# Altium project PCB_Project.PrjPcb
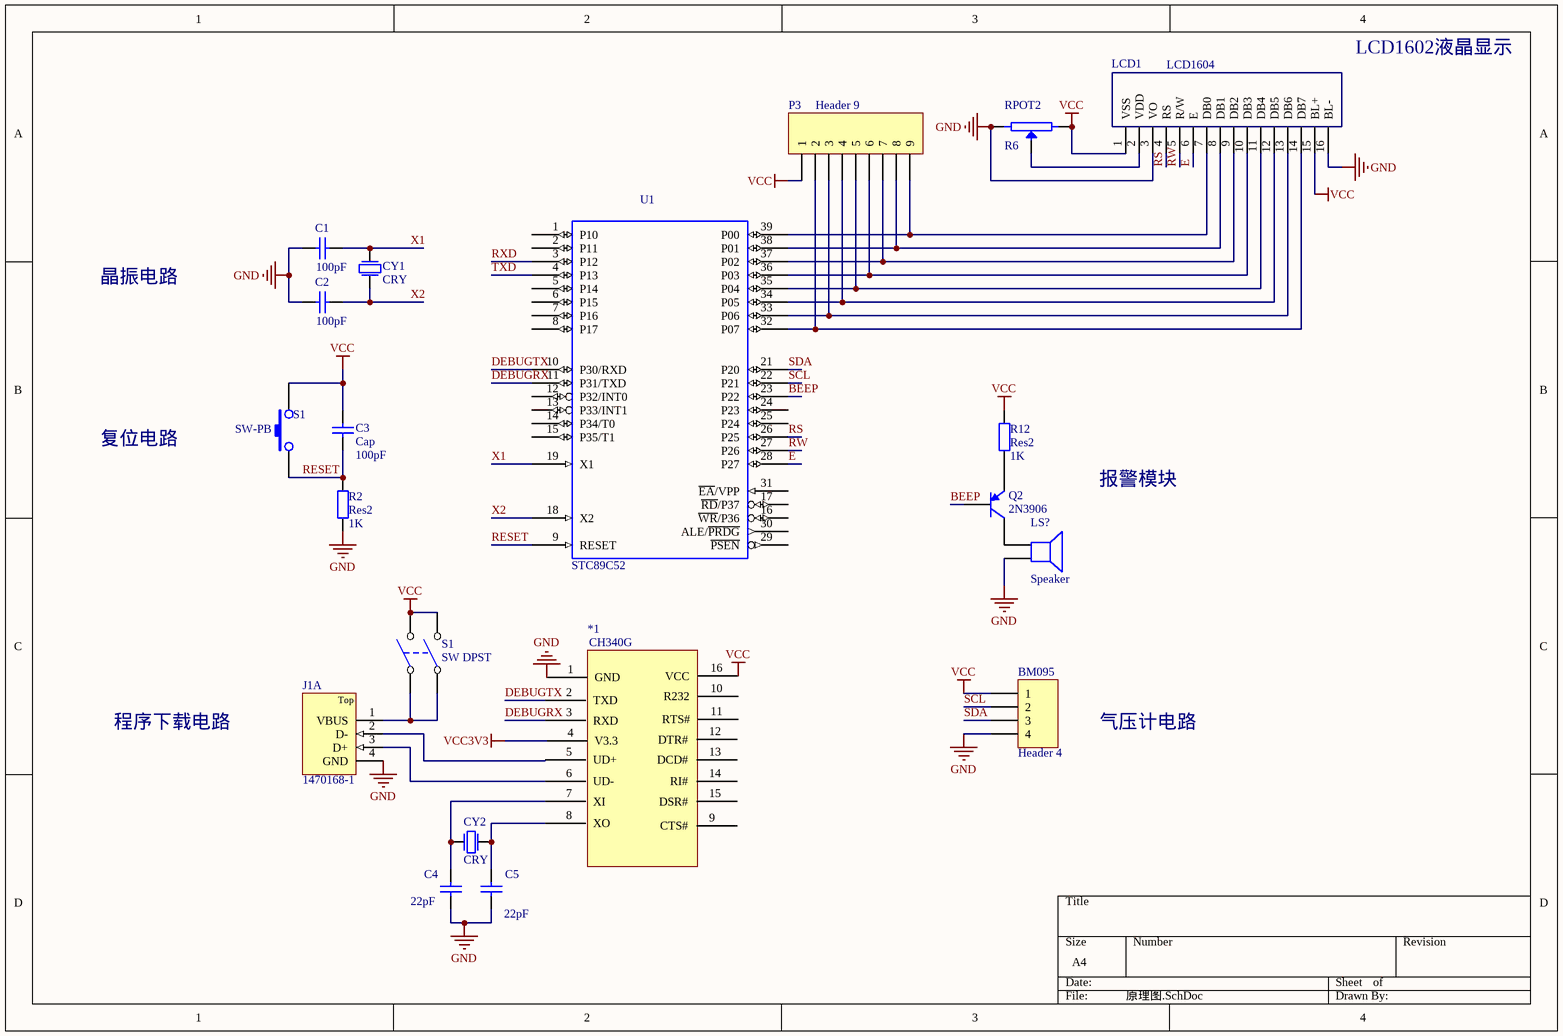
[diagram p0: 原理图.SchDoc]
1 sheet, 20 parts. Net scope: global (net labels, ports and power ports of the same name join across sheets).

## Sheet 原理图.SchDoc
size A4

### Parts
(Parts that share a designator on the sheet are numbered #1, #2 ... from top to bottom, then left to right.)
*1  Component_1  (value not drawn)
BM095  Header 4  [HDR1X4]
C1  value 100pF  [RAD-0.3]  (hidden comment: Cap)
C2  value 100pF  [RAD-0.3]  (hidden comment: Cap)
C3  Cap  value 100pF  [RAD-0.3]
C4  value 22pF  [RAD-0.3]  (hidden comment: Cap)
C5  value 22pF  [RAD-0.3]  (hidden comment: Cap)
CY1  CRY  [XTAL-1]
CY2  CRY  [XTAL-1]
J1  1470168-1  [1470168]  (part A of 3)
LCD1  LCD1604  [LCD1602]
LS?  Speaker  [PIN2]
P3  Header 9  [HDR1X9]
Q2  2N3906  [TO-92A]
R2  Res2  value 1K  [AXIAL-0.4]
R6  RPOT2  [VR5]
R12  Res2  value 1K  [AXIAL-0.4]
S1#1  SW-PB
S1#2  SW DPST
U1  STC89C52  [DIP-40]

### Nets
GND: *1.1(GND) BM095.4 C1.1 C2.1 C4.2 C5.1 J1.4(GND) LCD1.3(VO) LCD1.16(BL-) LS?.2 R2.1 R6.3 U1.20(GND)
VCC: *1.16(VCC) BM095.1 C3.2 LCD1.1(VSS) LCD1.15(BL+) P3.1 R6.1 R12.2 S1#1.2 S1#2.2(NO1) S1#2.4(NO2) U1.40(VCC)
VCC3V3: *1.4(V3.3)
BEEP: Q2.2(B) U1.23(P22)
DEBUGRX: *1.3(RXD) U1.11(P31/TXD)
DEBUGTX: *1.2(TXD) U1.10(P30/RXD)
E: LCD1.6(E) U1.28(P27)
RESET: C3.1 R2.2 S1#1.1 U1.9(RESET)
RS: LCD1.4(RS) U1.26(P25)
RW: LCD1.5(R/W) U1.27(P26)
RXD: U1.3(P12)
SCL: BM095.2 U1.22(P21)
SDA: BM095.3 U1.21(P20)
TXD: U1.4(P13)
X1: C1.2 CY1.1(P1) U1.19(X1)
X2: C2.2 CY1.2(P2) U1.18(X2)
Net*1_6: *1.6(UD-) J1.3(D+)
Net*1_7: *1.7(XI) C4.1 CY2.1(P1)
Net*1_8: *1.8(XO) C5.2 CY2.2(P2)
NetJ1_1: J1.1(VBUS) S1#2.1(COMMON1) S1#2.3(COMMON2)
NetLCD1_2: LCD1.2(VDD) R6.2(VT)
NetLCD1_7: LCD1.7(DB0) P3.9 U1.39(P00)
NetLCD1_8: LCD1.8(DB1) P3.8 U1.38(P01)
NetLCD1_9: LCD1.9(DB2) P3.7 U1.37(P02)
NetLCD1_10: LCD1.10(DB3) P3.6 U1.36(P03)
NetLCD1_11: LCD1.11(DB4) P3.5 U1.35(P04)
NetLCD1_12: LCD1.12(DB5) P3.4 U1.34(P05)
NetLCD1_13: LCD1.13(DB6) P3.3 U1.33(P06)
NetLCD1_14: LCD1.14(DB7) P3.2 U1.32(P07)
NetLS?_1: LS?.1 Q2.3(C)
NetQ2_1: Q2.1(E) R12.1

Not connected (* = marked no-connect by the designer): *1 5(UD+) 9(CTS#) 10(R232) 11(RTS#) 12(DTR#) 13(DCD#) 14(RI#) 15(DSR#); J1 2(D-); U1 1(P10) 2(P11) 5(P14) 6(P15) 7(P16) 8(P17) 12(P32/INT0) 13(P33/INT1) 14(P34/T0) 15(P35/T1) 16(~{WR}/P36) 17(~{RD}/P37) 24(P23) 25(P24) 29(~{PSEN}) 30(ALE/~{PRDG}) 31(~{EA}/VPP)

### Notes on the sheet
- LCD1602液晶显示
- 晶振电路
- 复位电路
- 报警模块
- 程序下载电路
- 气压计电路
- (in symbol 1470168-1, part A) Top
- (in symbol Component_1) CH340G

### Library data of the parts
BM095 = Header 4: Header, 4-Pin; LatestRevisionDate: 17-Jul-2002; LatestRevisionNote: Re-released for DXP Platform.; Publisher: Altium Limited
C1-C5 = Cap: Capacitor; Published: 8-Jun-2000; LatestRevisionDate: 17-Jul-2002; LatestRevisionNote: Re-released for DXP Platform.; PackageReference: RAD-0.3; Publisher: Altium Limited; PackageDescription: Radial Cap, Thru-Hole; 2 Leads; 0.3 in Pin Spacing
J1 = 1470168-1: USB 1.1, Right Angle, Thru-Hole, A Type, Receptacle, 4x4 Position, Stacked, Black; ContactMaterial: Copper Alloy; ContactPlating: Gold Flash; TerminationLength: 3.18mm [0.125in.]; PCB_Layout: Complies with manufacturer's recommendation.; DrillSize: Corresponds to nominal value.; PanelGround: Without; Published: 15-Jul-2004; DatasheetDocument: 15-Aug-2002; PackageDocument: 15-Aug-2002; PackageReference: 1470168; Publisher: Altium Limited; HousingMaterial: Glass-Filled Thermoplastic; ComponentLink1Description: Manufacturer Link; ComponentLink1URL: http://www.tycoelectronics.com/; ComponentLink2Description: Packaging Specification; ComponentLink2URL: http://ecommas.tycoelectronics.com/commerce/DocumentDelivery/DDEController?Action=showdoc&DocId=Customer+Drawing%7F1470168%7FA%7Fpdf%7FEnglish%7FC_1470168_A.pdf
LCD1 = LCD1602
LS? = Speaker: Loudspeaker; Published: 24-Mar-1999; LatestRevisionDate: 17-Jul-2002; LatestRevisionNote: Re-released for DXP Platform.; PackageReference: PIN2; Publisher: Altium Limited
P3 = Header 9: Header, 9-Pin; LatestRevisionDate: 17-Jul-2002; LatestRevisionNote: Re-released for DXP Platform.; Publisher: Altium Limited
Q2 = 2N3906: PNP General Purpose Amplifier; Published: 8-Jun-2000; LatestRevisionDate: 15-Jan-2003; LatestRevisionNote: PCB Footprint 'BCY-W3/D4.7' replaced; DatasheetVersion: 1997; PackageVersion: Sep-1998; PackageReference: TO-92A; Publisher: Altium Limited; PackageDescription: TO, Flat Index; 3 In-Line, Axial Leads; Body Dia. 4.5mm; Leads 0.51 x 0.48 mm (max); ComponentLink1Description: Manufacturer Link; ComponentLink1URL: http://www.fairchildsemi.com/; ComponentLink2Description: Datasheet; ComponentLink2URL: http://www.fairchildsemi.com/ds/2N%2F2N3906.pdf
R2 R12 = Res2: Resistor; Published: 8-Jun-2000; LatestRevisionDate: 17-Jul-2002; LatestRevisionNote: Re-released for DXP Platform.; PackageReference: AXIAL-0.4; Publisher: Altium Limited; PackageDescription: Axial Device, Thru-Hole; 2 Leads; 0.4 in Pin Spacing
R6 = RPOT2: Potentiometer
U1 = AT89C51